# EAGLE design Tracksoar SD shield (EAGLE 7.3.0)
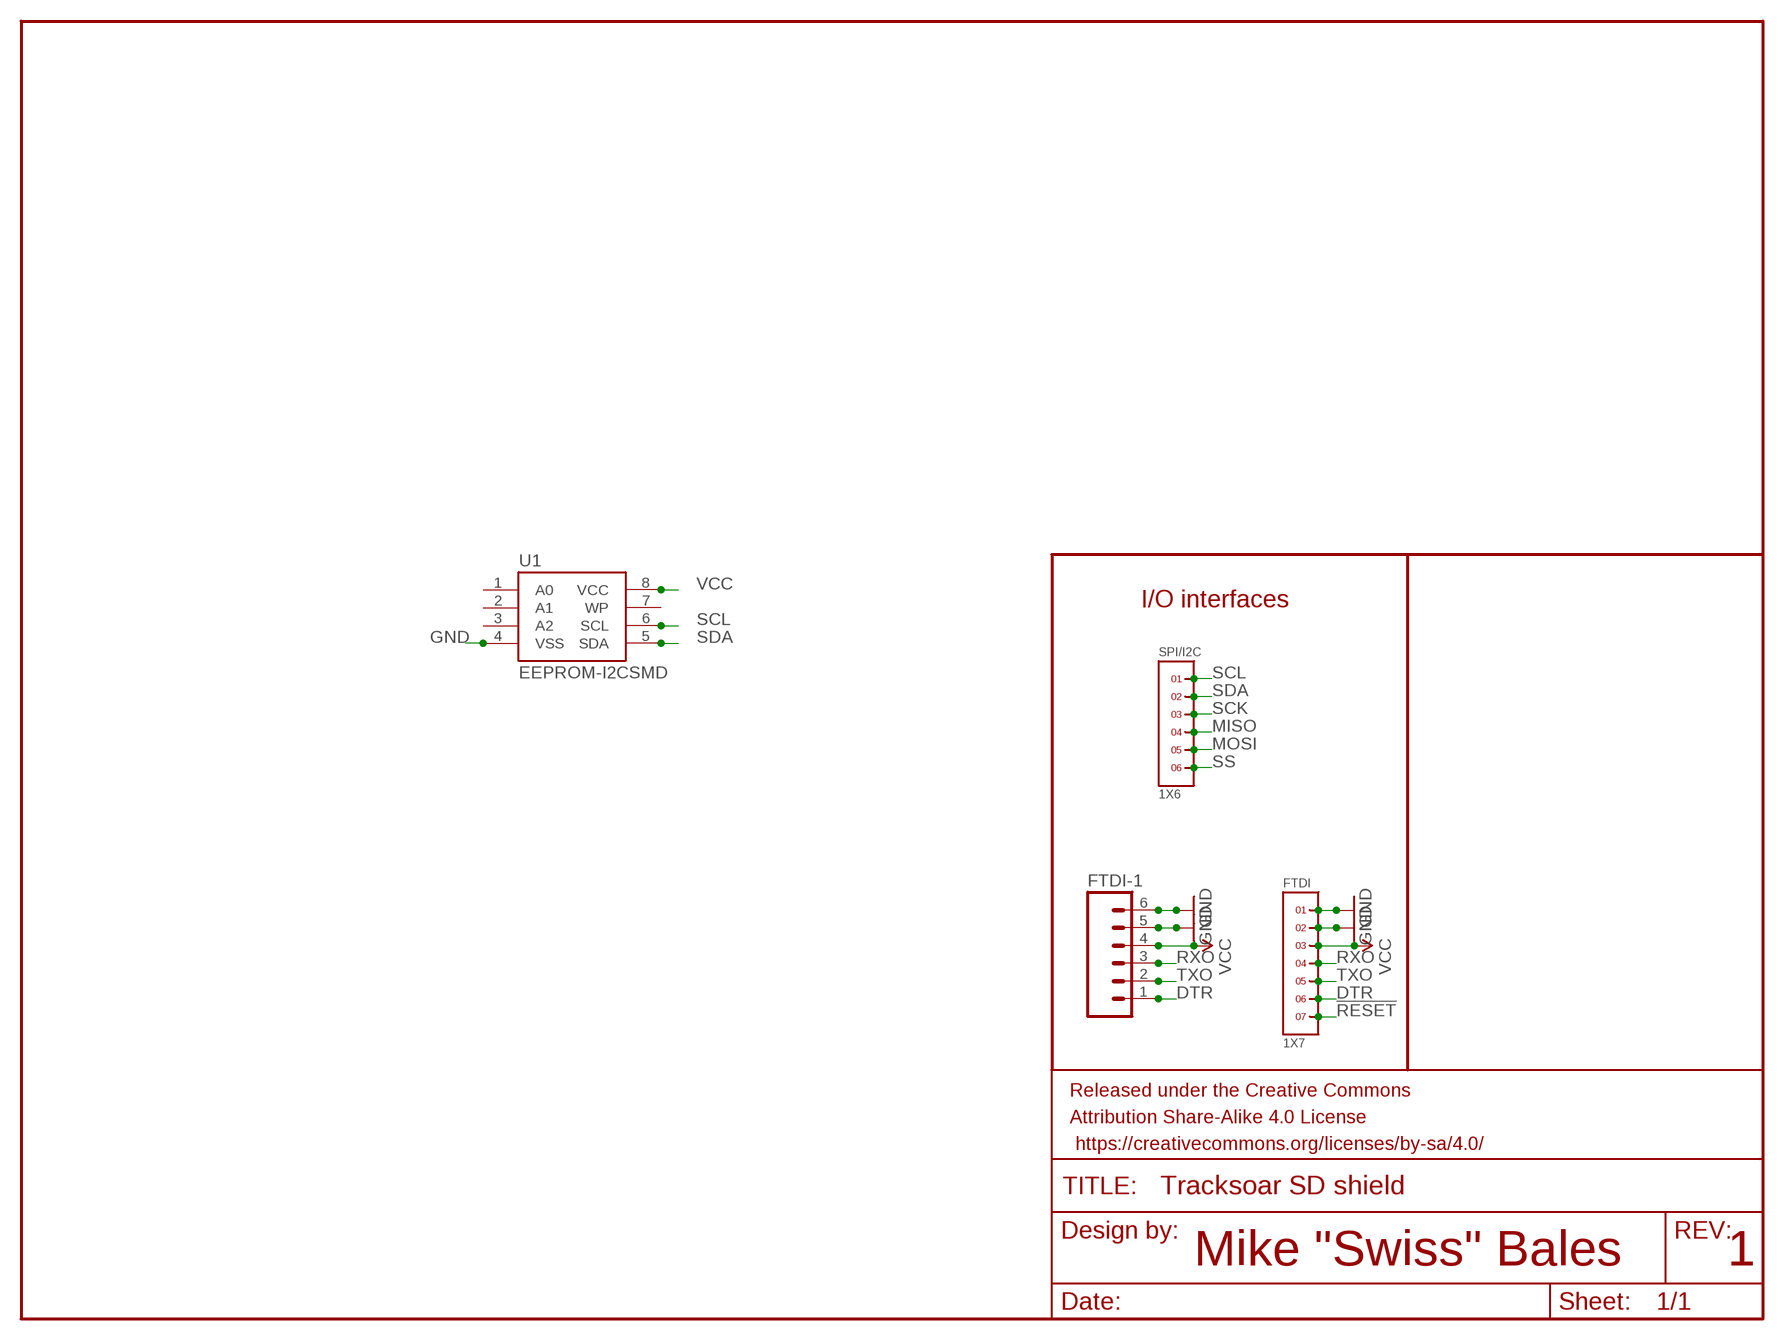
[diagram p0: schematic, sheet 1]

## Parts
FRAME1  FRAME-LETTER  [CREATIVE_COMMONS]
FTDI  1X7  [1X7]
FTDI-1  M06LOCK_LONGPADS  [1X06_LOCK_LONGPADS]
SPI/I2C  1X6  [1X6]
U1  EEPROM-I2CSMD  [SO08]

## Nets
!RESET: FTDI.7
DTR: FTDI-1.1 FTDI.6
GND: FTDI-1.5 FTDI-1.6 FTDI.1 FTDI.2 U1.4(VSS)
MISO: SPI/I2C.4
MOSI: SPI/I2C.5
RXO: FTDI-1.3 FTDI.4
SCK: SPI/I2C.3
SCL: SPI/I2C.1 U1.6(SCL)
SDA: SPI/I2C.2 U1.5(SDA)
SS: SPI/I2C.6
TXO: FTDI-1.2 FTDI.5
VCC: FTDI-1.4 FTDI.3 U1.8(VCC)
Unconnected: U1.1(A0) U1.2(A1) U1.3(A2) U1.7(WP)

## Notes on the sheet
- I/O interfaces
- Mike "Swiss" Bales | 1

## Library data of the parts
FRAME1 = SparkFun-Aesthetics:FRAME-LETTER: Schematic Frame Standard 8.5x11 US Letter frame
FTDI = headers(2mm):1X7
FTDI-1 = SparkFun-Connectors:M06: Header 6 Standard 6-pin 0.1" header. Use with straight break away headers (SKU : PRT-00116), right angle break away headers (PRT-00553), swiss pins (PRT-00743), machine pins (PRT-00117), and female headers (PRT-00115). Molex polarized connector foot print use with SKU : PRT-08094 with associated crimp pins and housings. NOTES ON THE VARIANTS LOCK and LOCK_LONGPADS... This footprint was designed to help hold the alignment of a through-hole component (i.e. 6-pin header) while soldering it into place. You may notice that each hole has been shifted either up or down by 0.005 of an inch from it's more standard position (which is a perfectly straight line). This slight alteration caused the pins (the squares in the middle) to touch the edges of the holes. Because they are alternating, it causes a "brace" to hold the component in place. 0.005 has proven to be the perfect amount of "off-center" position when using our standard breakaway headers. Although looks a little odd when you look at the bare footprint, once you have a header in there, the alteration is very hard to notice. Also,if you push a header all the way into place, it is covered up entirely on the bottom side. This idea of altering the position of holes to aid alignment will be further integrated into the Sparkfun Library for other footprints. It can help hold any component with 3 or more connection pins.
SPI/I2C = headers(2mm):1X6
U1 = SparkFun-DigitalIC:EEPROM-I2C: I2C EEPROM chips, 24LC256 (and others)

## Board
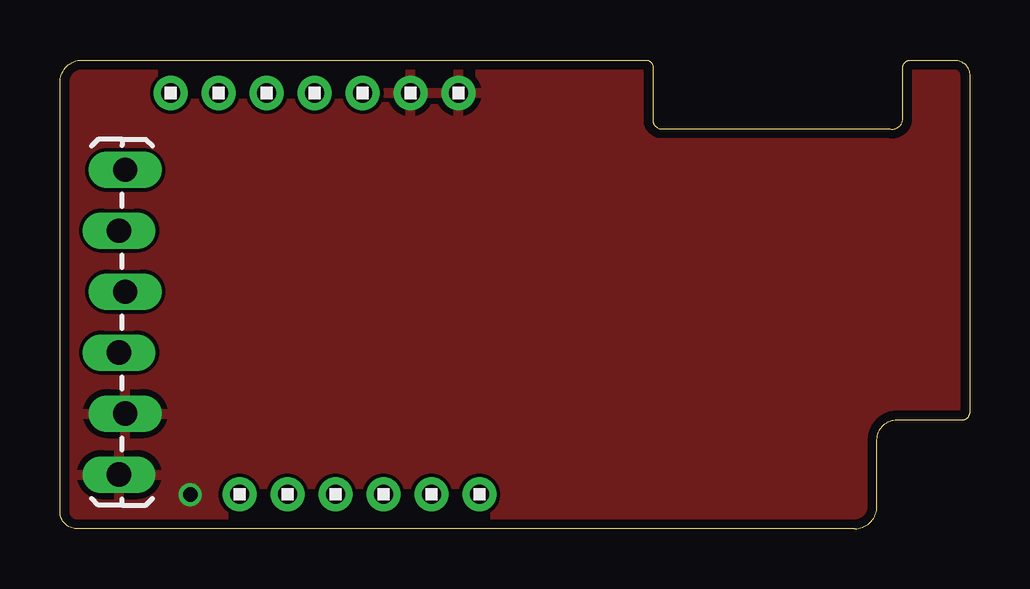
[diagram p1: board, top side]
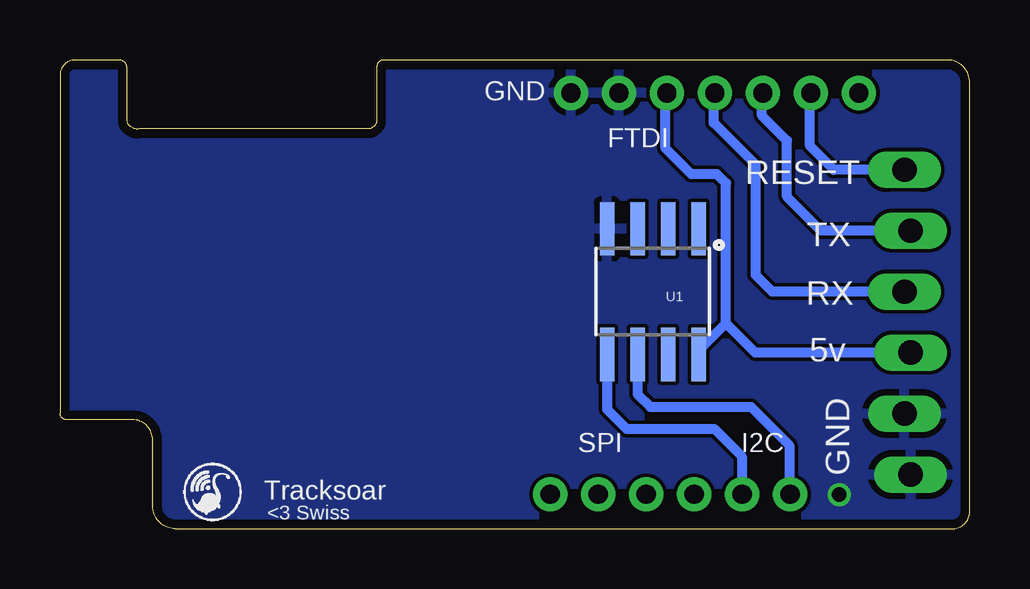
[diagram p2: board, bottom side, seen from below]

Size 37.92 x 19.53 mm. Coordinates in mm from the lower left corner, seen from the top.
Outline: 0.69,0 arc-90 0,0.76 0,18.67 arc-90 0.99,19.53 24.46,19.53 arc-90 24.71,19.23 24.71,17.02 arc90 25.12,16.66 34.62,16.66 arc90 35.13,17.02 35.13,19.23 arc-90 35.48,19.53 37.31,19.53 arc-90 37.92,18.87 37.92,4.83 arc-90 37.64,4.55 34.9,4.55 arc90 34.06,3.71 34.06,0.94 arc-90 33.12,0 0.69,0
Copper layers (1*16): Top 0.0356mm / dielectric 1.5011mm / Bottom 0.0356mm
Design rules "oshpark-2layer": minimum track width 6mil, minimum drill 13mil, track to track 6mil, track to pad 6mil, pad to pad 6mil, via to via 6mil, smd to smd 6mil, copper to edge 15mil, drill to drill 6mil, minimum pad ring 7mil, minimum via ring 7mil, stop-mask expansion 4mil, vias tented up to drill 0mil, thermal gap 10mil

### Footprints (pad centres in the part's own frame; a part is rotated, then mirrored left to right if it is on the bottom)
1X7 = drill 0.8 pad 1.422: 1 -6,0; 2 -4,0; 3 -2,0; 4 0,0; 5 2,0; 6 4,0; 7 6,0
1X06_LOCK_LONGPADS = drill 1.016 long: 1 0,0; 2 2.54,-0.254; 3 5.08,0; 4 7.62,-0.254; 5 10.16,0; 6 12.7,-0.254
1X6 = drill 0.8 pad 1.422: 1 -5,0; 2 -3,0; 3 -1,0; 4 1,0; 5 3,0; 6 5,0
SO08 = smd 0.61 x 2.21: 1 -1.905,-2.616; 2 -0.635,-2.616; 3 0.635,-2.616; 4 1.905,-2.616; 5 1.905,2.616; 6 0.635,2.616; 7 -0.635,2.616; 8 -1.905,2.616

### Placement (x,y rotation side)
FRAME1  8.28,-8.18 0 top  (outside the outline)
FTDI  10.62,18.16 180 top
FTDI-1  2.72,14.96 270 top
SPI/I2C  12.48,1.43 0 top
U1  13.21,9.88 180 bottom

### Tracks (layer width: path | path; a pad name or v marks a point on that pad's centre or on a via)
DTR
  Bottom 0.406: FTDI-1.1 5.66,14.96 6.66,15.95 6.66,18.12 FTDI.6
GND  (via drill 0.6)
  other vias: 5.44,1.42
  pour Bottom: -0.02,19.48 -0.02,-0.03 34.14,-0.03 34.14,4.62 37.97,4.62 37.97,19.51 35.13,19.51 35.13,16.69 24.74,16.69 24.74,19.48
  pour Top: -0.02,19.48 -0.02,-0.03 34.14,-0.03 34.14,4.62 37.97,4.62 37.97,19.51 35.13,19.51 35.13,16.69 24.74,16.69 24.74,19.48
RXO
  Bottom 0.406: FTDI-1.3 8.23,9.88 8.92,10.57 8.92,15.16 10.67,16.92 10.67,18.11 FTDI.4
SCL
  Bottom 0.406: U1.6 13.84,5.61 13.31,5.08 9.12,5.08 7.52,3.48 7.52,1.47 SPI/I2C.1
SDA
  Bottom 0.406: U1.5 15.11,4.98 14.3,4.17 10.64,4.17 9.5,3.02 9.5,1.45 SPI/I2C.2
TXO
  Bottom 0.406: FTDI-1.2 6.2,12.42 7.62,13.84 7.62,16.18 8.66,17.22 8.66,18.12 FTDI.5
VCC
  Bottom 0.406: U1.8 11.3,7.42 10.16,8.56 | 10.16,8.56 10.16,14.4 10.54,14.78 11.61,14.78 12.68,15.85 12.68,18.1 FTDI.3 | FTDI-1.4 8.94,7.34 10.16,8.56

### Text on the board
bNames: GND | FTDI | RESET | TX | RX | 5v | GND | I2C | SPI | Tracksoar | <3 Swiss